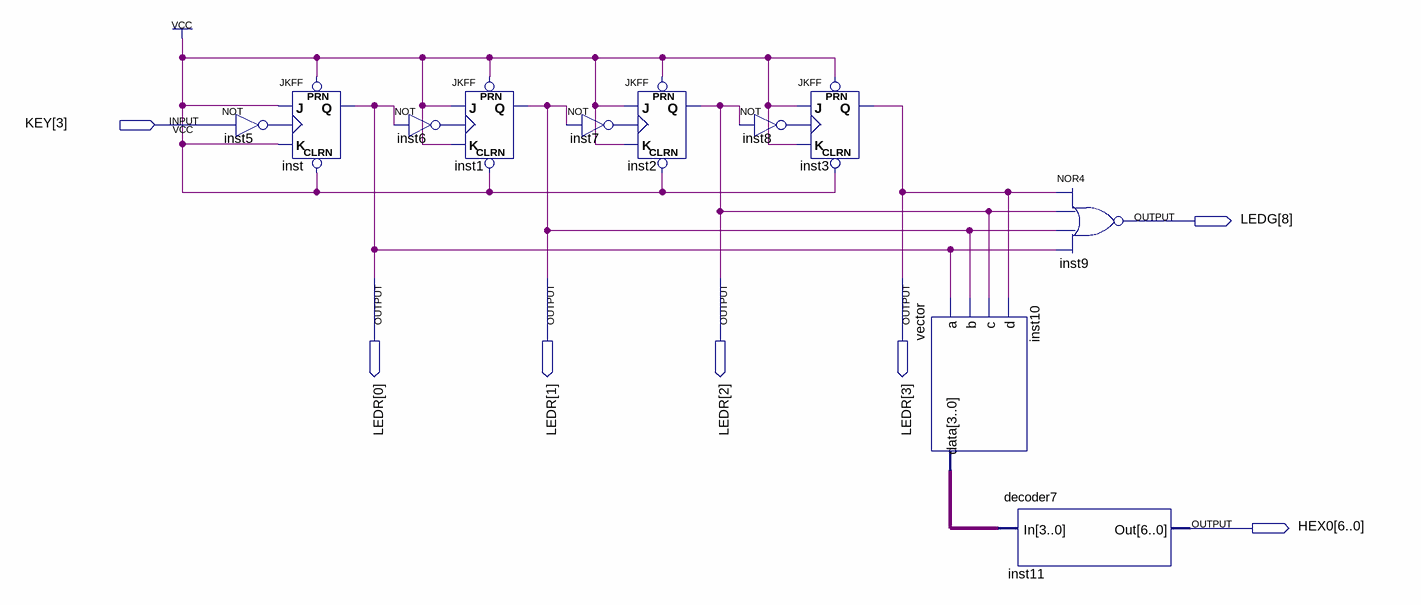
[diagram p0: schematic sheet]
// Quartus schematic Exp82n.bdf as structural Verilog: 11 symbols, 7 pins
module Exp82n (
  input  [3:3] KEY,
  output [8:8] LEDG,
  output [3:0] LEDR,
  output [6:0] HEX0
);

  wire inst5_out, inst6_out, inst7_out, inst8_out;
  wire [3:0] inst10_data;

  JKFF inst (.PRN(1'b1), .CLRN(1'b1), .K(1'b1), .J(1'b1), .CLK(inst5_out), .Q(LEDR[0]));
  not inst5 (inst5_out, KEY[3]);
  not inst6 (inst6_out, LEDR[0]);
  JKFF inst1 (.PRN(1'b1), .CLRN(1'b1), .K(1'b1), .J(1'b1), .CLK(inst6_out), .Q(LEDR[1]));
  not inst7 (inst7_out, LEDR[1]);
  JKFF inst2 (.PRN(1'b1), .CLRN(1'b1), .K(1'b1), .J(1'b1), .CLK(inst7_out), .Q(LEDR[2]));
  not inst8 (inst8_out, LEDR[2]);
  JKFF inst3 (.PRN(1'b1), .CLRN(1'b1), .K(1'b1), .J(1'b1), .CLK(inst8_out), .Q(LEDR[3]));
  vector inst10 (.a(LEDR[0]), .b(LEDR[1]), .c(LEDR[2]), .d(LEDR[3]), .data(inst10_data));
  decoder7 inst11 (.In(inst10_data), .Out(HEX0));
  nor inst9 (LEDG[8], LEDR[3], LEDR[2], LEDR[1], LEDR[0]);
endmodule
